# Altium schematic sheet BLDC-PWR-CONROLLER.SchDoc
size 420 x 297 mm; DocumentNumber: АБВГ.000000.000 Э3; SheetNumber: 4; PageSetup: Record=PageOptions|CenterHorizontal=False|CenterVertical=False|PrintScale=0.95|XCorrection=0.00|YCorrection=0.00|PrintKind=1|BorderSize=5000000|LeftOffset=0|BottomOffset=0|Orientation=1|PaperLength=1000|PaperWidth=1000|Scale=100|PaperSource=15|PrintQuality=600|MediaType=1|DitherType=10|PaperKind=A4|PrintScaleMode=1; Letter1Column: {}; Letter2Column: {}; Letter3Column: {}; ProcessInspection: ProcessInspection; EngineerName: EngineerName; NormInspection: NormInspection; DocumentType: DocumentType; Mass: Mass; Scale: Scale; Developer1size1str: Developer1size1str; Developer2size1str: Developer2size1str; Developer2size2str: Developer2size2str; Title1size1str: Title1size1str; Title2size1str: Title2size1str; Title2size2str: Title2size2str; Title3size3str: Title3size3str; Title3size2str: Title3size2str; Title3size1str: Title3size1str; FunctionalGroup: #_
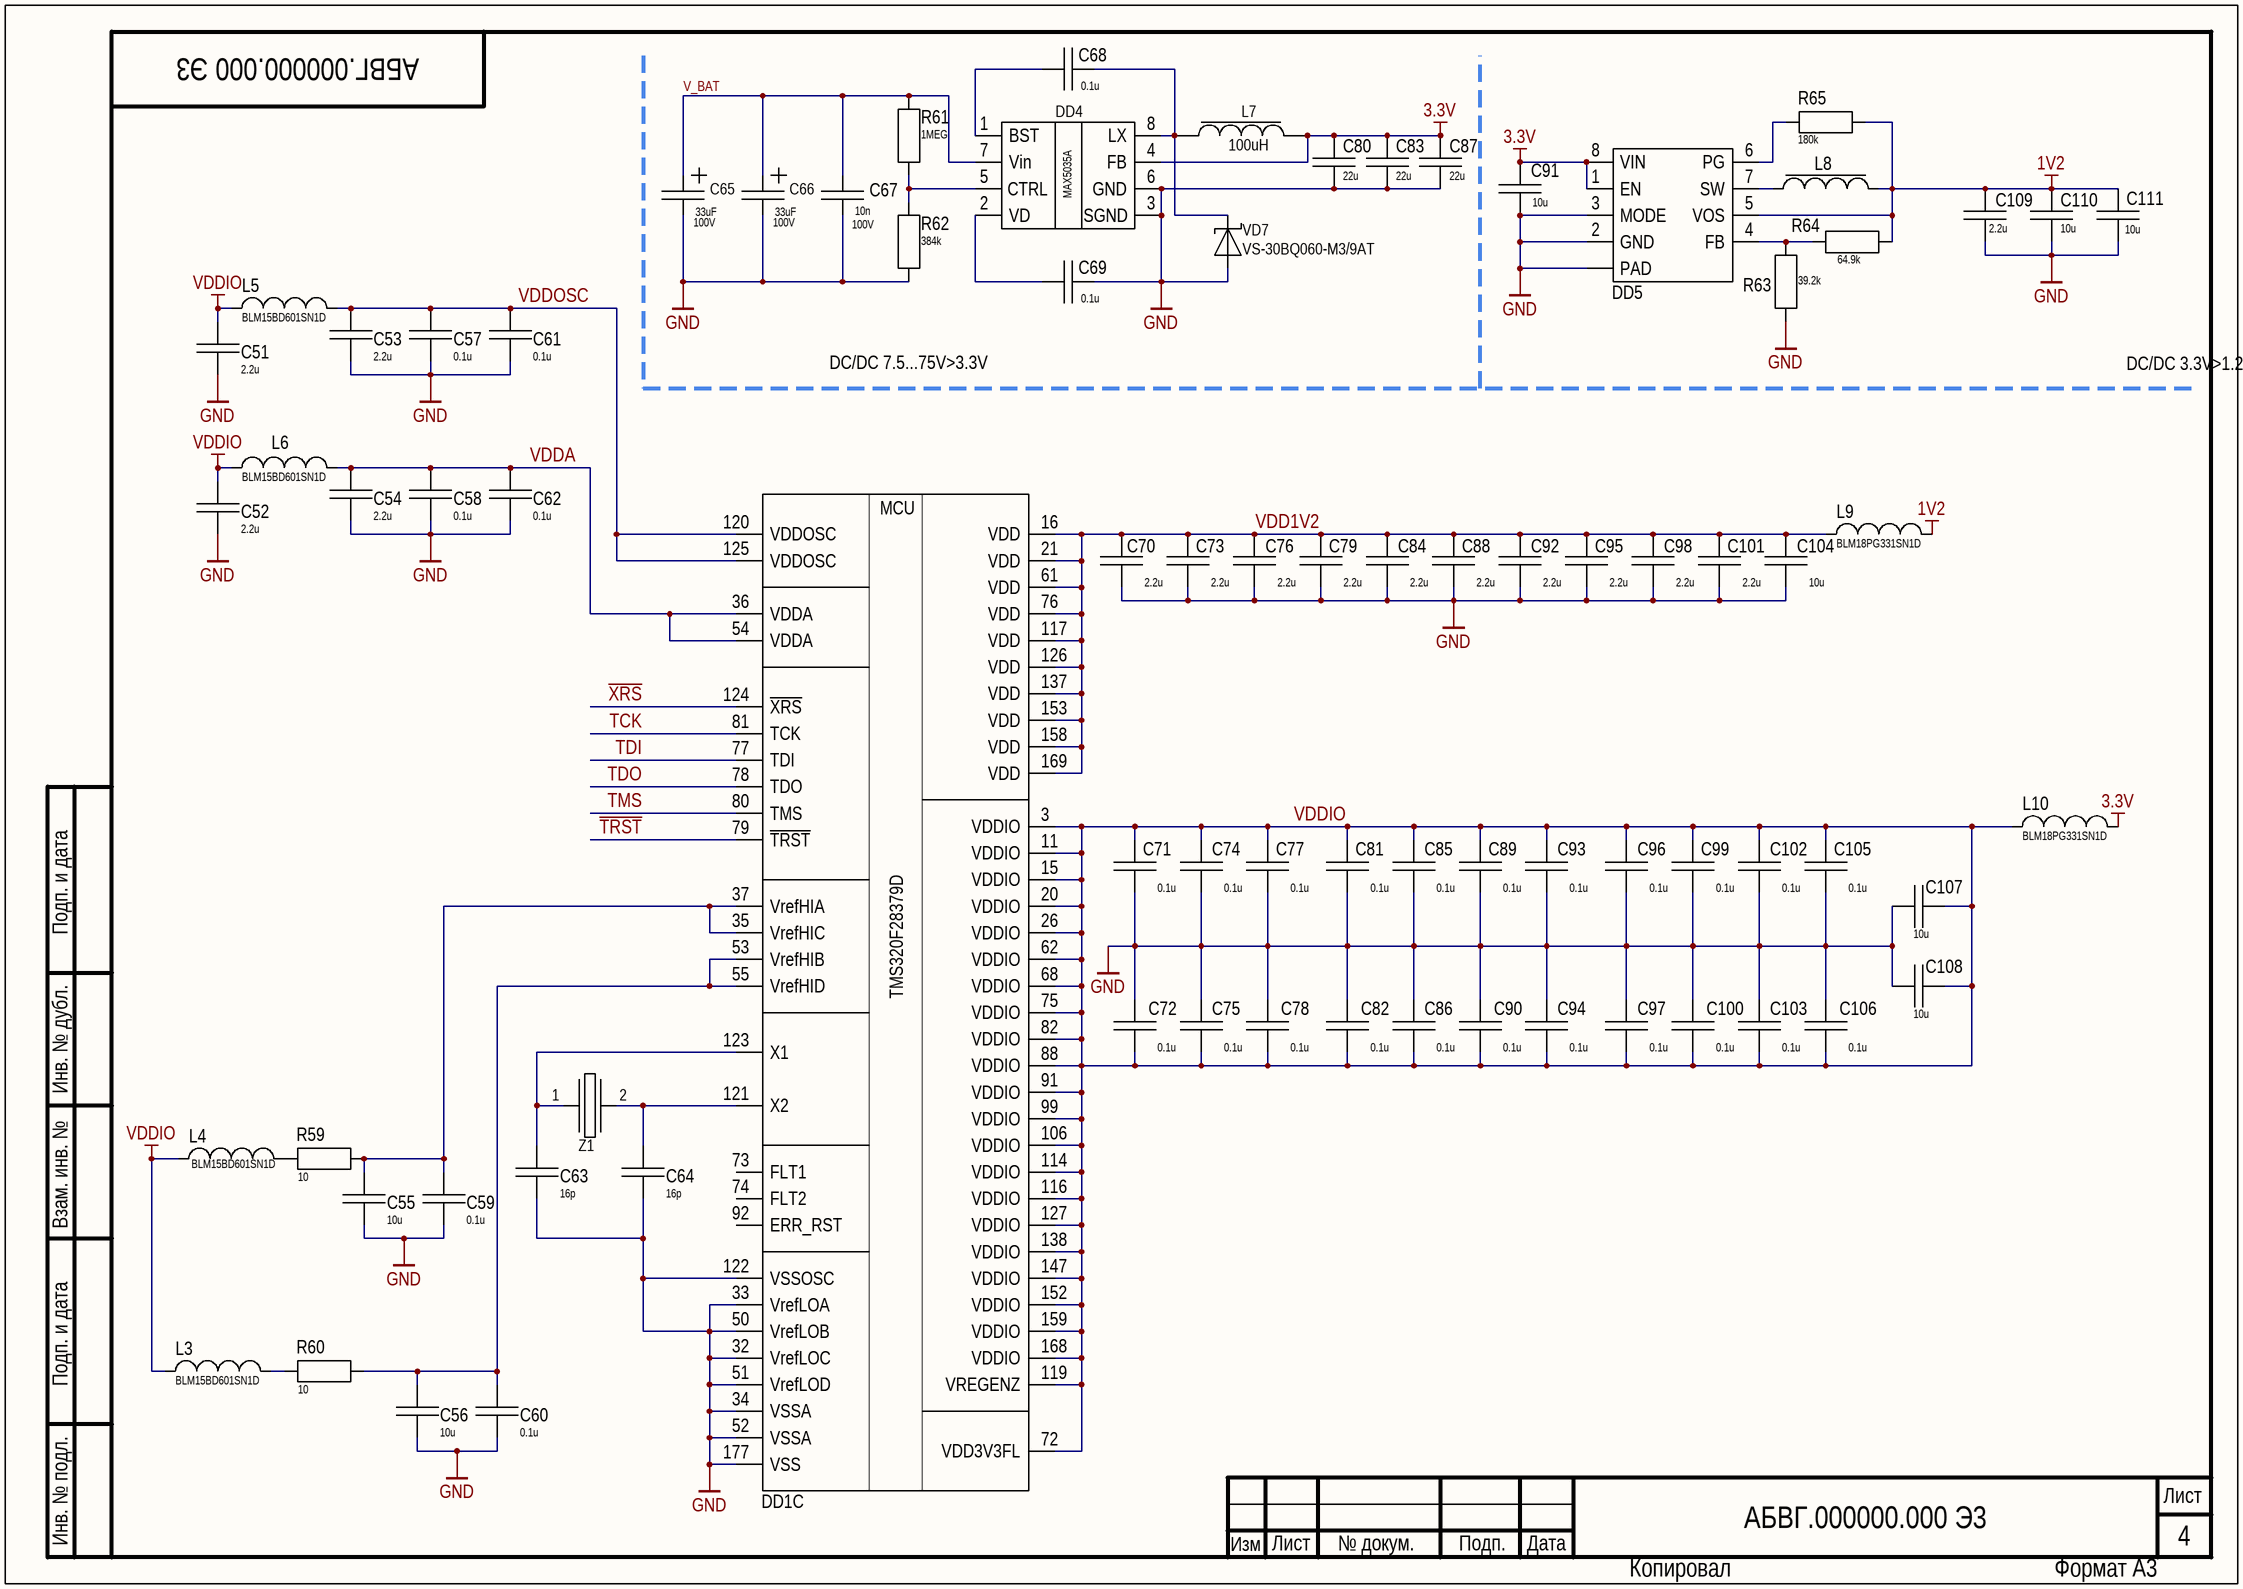
[diagram p0: BLDC-PWR-CONROLLER.SchDoc]

## Parts
C51  2.2u  [CAP: 0402]
C52  2.2u  [CAP: 0402]
C53  2.2u  [CAP: 0402]
C54  2.2u  [CAP: 0402]
C55  10u  [CAP: 0402]
C56  10u  [CAP: 0402]
C57  0.1u  [CAP: 0402]
C58  0.1u  [CAP: 0402]
C59  0.1u  [CAP: 0402]
C60  0.1u  [CAP: 0402]
C61  0.1u  [CAP: 0402]
C62  0.1u  [CAP: 0402]
C63  16p  [CAP: 0402]
C64  16p  [CAP: 0402]
C65  value 33uF  Voltage: 100V  [ECR08]  (hidden comment: ECR0812)
C66  value 33uF  Voltage: 100V  [ECR08]  (hidden comment: ECR0812)
C67  value 10n  Voltage: 100V  [CAP: 0603]
C68  0.1u  [CAP: 0402]
C69  0.1u  [CAP: 0402]
C70  2.2u  [CAP: 0402]
C71  0.1u  [CAP: 0402]
C72  0.1u  [CAP: 0402]
C73  2.2u  [CAP: 0402]
C74  0.1u  [CAP: 0402]
C75  0.1u  [CAP: 0402]
C76  2.2u  [CAP: 0402]
C77  0.1u  [CAP: 0402]
C78  0.1u  [CAP: 0402]
C79  2.2u  [CAP: 0402]
C80  22u  [CAP: 0805]
C81  0.1u  [CAP: 0402]
C82  0.1u  [CAP: 0402]
C83  22u  [CAP: 0805]
C84  2.2u  [CAP: 0402]
C85  0.1u  [CAP: 0402]
C86  0.1u  [CAP: 0402]
C87  22u  [CAP: 0805]
C88  2.2u  [CAP: 0402]
C89  0.1u  [CAP: 0402]
C90  0.1u  [CAP: 0402]
C91  10u  [CAP: 0805]
C92  2.2u  [CAP: 0402]
C93  0.1u  [CAP: 0402]
C94  0.1u  [CAP: 0402]
C95  2.2u  [CAP: 0402]
C96  0.1u  [CAP: 0402]
C97  0.1u  [CAP: 0402]
C98  2.2u  [CAP: 0402]
C99  0.1u  [CAP: 0402]
C100  0.1u  [CAP: 0402]
C101  2.2u  [CAP: 0402]
C102  0.1u  [CAP: 0402]
C103  0.1u  [CAP: 0402]
C104  10u  [CAP: 0402]
C105  0.1u  [CAP: 0402]
C106  0.1u  [CAP: 0402]
C107  10u  [CAP: 0402]
C108  10u  [CAP: 0402]
C109  2.2u  [CAP: 0402]
C110  10u  [CAP: 0805]
C111  10u  [CAP: 0805]
DD1  TMS320F28379DPTP_LACID  [176-HLQFP]  (value not drawn)  (part C of 3)
DD4  MAX5035A  [SOIC-8-150-1.27]
DD5  TPS62080ADSGT  [8-WSON 2.1x2.1]  (value not drawn)
L3  BLM15BD601SN1D  [IND: 0402]
L4  BLM15BD601SN1D  [IND: 0402]
L5  BLM15BD601SN1D  [IND: 0402]
L6  BLM15BD601SN1D  [IND: 0402]
L7  value 100uH  [IND: SRR1208]
L8  LQH3NPN  [IND: LQH3NP]  (value not drawn)
L9  BLM18PG331SN1D  [IND: 0603]
L10  BLM18PG331SN1D  [IND: 0603]
R59  10  [RES: 0402]
R60  10  [RES: 0402]
R61  1MEG  [RES: 0402]
R62  384k  [RES: 0402]
R63  39.2k  [RES: 0402]
R64  64.9k  [RES: 0402]
R65  180k  [RES: 0402]
VD7  PartNumber: VS-30BQ060-M3/9AT  [DIODE: SMC]
Z1  (no value)  [OSC: HC49SM]

## Nets
1V2: C109.2 C110.2 C111.2 DD5.5(VOS) L8.1 L9.2 R64.1 R65.1
3.3V: C80.2 C83.2 C87.2 C91.2 DD4.4(FB) DD5.1(EN) DD5.8(VIN) L7.1 L10.2
GND: C51.1 C52.1 C53.1 C54.1 C55.1 C56.1 C57.1 C58.1 C59.1 C60.1 C61.1 C62.1 C63.1 C64.1 C65.2 C66.2 C67.1 C69.1 C70.1 C71.1 C72.2 C73.1 C74.1 C75.2 C76.1 C77.1 C78.2 C79.1 C80.1 C81.1 C82.2 C83.1 C84.1 C85.1 C86.2 C87.1 C88.1 C89.1 C90.2 C91.1 C92.1 C93.1 C94.2 C95.1 C96.1 C97.2 C98.1 C99.1 C100.2 C101.1 C102.1 C103.2 C104.1 C105.1 C106.2 C107.2 C108.2 C109.1 C110.1 C111.1 DD1.32(VrefLOC) DD1.33(VrefLOA) DD1.34(VSSA) DD1.50(VrefLOB) DD1.51(VrefLOD) DD1.52(VSSA) DD1.122(VSSOSC) DD1.177(VSS) DD4.3(SGND) DD4.6(GND) DD5.0(PAD) DD5.2(GND) DD5.3(MODE) R62.1 R63.1 VD7.1
VDDIO: C51.2 C52.2 C71.2 C72.1 C74.2 C75.1 C77.2 C78.1 C81.2 C82.1 C85.2 C86.1 C89.2 C90.1 C93.2 C94.1 C96.2 C97.1 C99.2 C100.1 C102.2 C103.1 C105.2 C106.1 C107.1 C108.1 DD1.3(VDDIO) DD1.11(VDDIO) DD1.15(VDDIO) DD1.20(VDDIO) DD1.26(VDDIO) DD1.62(VDDIO) DD1.68(VDDIO) DD1.72(VDD3V3FL) DD1.75(VDDIO) DD1.82(VDDIO) DD1.88(VDDIO) DD1.91(VDDIO) DD1.99(VDDIO) DD1.106(VDDIO) DD1.114(VDDIO) DD1.116(VDDIO) DD1.119(VREGENZ) DD1.127(VDDIO) DD1.138(VDDIO) DD1.147(VDDIO) DD1.152(VDDIO) DD1.159(VDDIO) DD1.168(VDDIO) L3.1 L4.1 L5.1 L6.1 L10.1
~{TRST}: DD1.79(~{TRST})
TCK: DD1.81(TCK)
TDI: DD1.77(TDI)
TDO: DD1.78(TDO)
TMS: DD1.80(TMS)
V_BAT: C65.1 C66.1 C67.2 DD4.7(Vin) R61.2
VDD1V2: C70.2 C73.2 C76.2 C79.2 C84.2 C88.2 C92.2 C95.2 C98.2 C101.2 C104.2 DD1.16(VDD) DD1.21(VDD) DD1.61(VDD) DD1.76(VDD) DD1.117(VDD) DD1.126(VDD) DD1.137(VDD) DD1.153(VDD) DD1.158(VDD) DD1.169(VDD) L9.1
VDDA: C54.2 C58.2 C62.2 DD1.36(VDDA) DD1.54(VDDA) L6.2
VDDOSC: C53.2 C57.2 C61.2 DD1.120(VDDOSC) DD1.125(VDDOSC) L5.2
~{XRS}: DD1.124(~{XRS})
NetC55_2: C55.2 C59.2 DD1.35(VrefHIC) DD1.37(VrefHIA) R59.1
NetC56_2: C56.2 C60.2 DD1.53(VrefHIB) DD1.55(VrefHID) R60.1
NetC63_2: C63.2 DD1.123(X1) Z1.1
NetC64_2: C64.2 DD1.121(X2) Z1.2
NetC68_1: C68.1 DD4.8(LX) L7.2 VD7.2
NetC68_2: C68.2 DD4.1(BST)
NetC69_2: C69.2 DD4.2(VD)
NetDD4_5: DD4.5(CTRL) R61.1 R62.2
NetDD5_4: DD5.4(FB) R63.2 R64.2
NetDD5_6: DD5.6(PG) R65.2
NetDD5_7: DD5.7(SW) L8.2
NetL3_2: L3.2 R60.2
NetL4_2: L4.2 R59.2

Not connected (* = marked no-connect by the designer): DD1 73(FLT1) 74(FLT2) 92(ERR_RST)

## Notes on the sheet
- DC/DC 7.5...75V>3.3V
- DC/DC 3.3V>1.2V
- Подп. и дата
- Инв. № дубл.
- Взам. инв. №
- Инв. № подл.
- Лист
- Изм
- № докум.
- Подп.
- Дата
- Копировал
- Формат А3
- (in symbol TMS320F28379DPTP_LACID, part C) MCU; TMS320F28379D

## Library data of the parts
C51-C56 C70 C73 C76 C79 C84 C88 C92 C95 C98 C101 C104 C107-C109 = CAP 0402: PartNumber: CC0402MRX5R5BB106; Voltage: 6.3V
  C51-C54 C70 C73 C76 C79 C84 C88 C92 C95 C98 C101 C109: Value: 2.2u
  C55 C56 C104 C107 C108: Value: 10u
C57-C62 C71 C72 C74 C75 C77 C78 C81 C82 C85 C86 C89 C90 C93 C94 C96 C97 C99 C100 C102 C103 C105 C106 = CAP 0402: PartNumber: C0402C104K8PAC; Manufacturer: Kemet; Voltage: 10V; Type: Capacitor; Temperature_Range: -55/+85; Tolerance: 10%; Value: 0.1u; Case: 0402
C63 C64 = CAP 0402: PartNumber: GRM1555C1H160JA01D; Manufacturer: Kemet; Voltage: 50V; Type: Capacitor; Temperature_Range: -55/+85; Tolerance: 10%; Value: 16p; Case: 0402
C65 C66 = ECR0812: PartNumber: JRB2A330M03500800120000B; Case: 8x12; Link: https://www.chipdip.by/product0/9000565862
C67 = Ceramic_0603: Manufacturer: murata; PartNumber: GRM188R72A103KA01D; ValueManufacturerPartNumber: Ceramic capacitor, 10n, X7R, ±10%, 100V, 0603, -55...+125°C; TypeCapacitor: Ceramic capacitor; Tolerance: ±10%; TypeDielectric: X7R; Package: 0603; HelpURL: https://www.chipdip.by/product/grm188r72a103ka01d; Temperature: -55...+125°C
C68 C69 = CAP 0402: Manufacturer: Kemet; Voltage: 100V; Type: Capacitor; Temperature_Range: -55/+85; Tolerance: 10%; Value: 0.1u; Case: 0402
C80 C83 C87 = CAP 0805: PartNumber: GRM21BR60J226M*; Voltage: 6.3V; Value: 22u
C91 C110 C111 = CAP 0805: PartNumber: CC0402MRX5R5BB106; Voltage: 6.3V; Value: 10u
DD1 = TMS320F28379DPTP_LACID: PartNumber: TMS320F28379DPTPT; Case: HLQFP-176
DD4 = MAX5035*
DD5 = TPS62080ADSGT: PartNumber: TPS61023DRLR
L7 = Inductor_SRR1208: Manufacturer: EPCOS; PartNumber: B82477G4104M000; TypeInductor: Fixed inductor; MaxCurrent: 1.7A; Tolerance: 20%; Link: https://www.chipdip.by/product/b82477g4104m; Temperature: -40...+150°C
L8 = LQH3NPN: PartNumber: LQH3NPN1R0NJ0L; Type: Chip Coil; Value: 1uH; Case: 1212; Max DC current: *
R59 R60 = RES 0402: PartNumber: RC0402FR-071KL; Tolerance: 1%; Value: 10; Manufacturer: *; Type: Resistor; Temperature_Range: *; Composition: *; Voltage: *; Case: 0402
R61-R63 = RES 0402: PartNumber: RC0402FR-1339K2L; Tolerance: 1%; Manufacturer: *; Type: Resistor; Temperature_Range: *; Composition: *; Voltage: *; Case: 0402
  R61: Value: 1MEG
  R62: Value: 384k
  R63: Value: 39.2k
R64 = RES 0402: PartNumber: RC0402FR-1364K9L; Tolerance: 1%; Value: 64.9k; Manufacturer: *; Type: Resistor; Temperature_Range: *; Composition: *; Voltage: *; Case: 0402
R65 = RES 0402: PartNumber: RC0402FR-07180RL; Tolerance: 1%; Value: 180k; Manufacturer: *; Type: Resistor; Temperature_Range: *; Composition: *; Voltage: *; Case: 0402
VD7 = Schottky_single: Manufacturer: Diodes Incorporated; ValueManufacturerPartNumber: Schottky diode, 80V, 500mA, 1V, 15pF, SOD-123, -55...+150°C; TypeDiode: Schottky diode; Voltage: 80V; Current: 500mA; VoltageDrop: 1V; RecoveryTime: 15pF; Package: SOD-123; HelpURL: https://www.digikey.com/product-detail/en/diodes-incorporated/MBR0580S1-7/MBR0580S1-7DICT-ND/5080371; Temperature: -55...+150°C
Z1 = Crystal_HC-49SM: Manufacturer: Epson; PartNumber: FC-135 32.7680KA-A5; ValueManufacturerPartNumber: Crystal, , 12.5pF, ±20ppm, case 3215, -40...+85°C; LoadCapacitance: 12.5pF; Tolerance: ±20ppm; Package: case 3215; HelpURL: https://www.digikey.com/product-detail/en/epson/FC-135-32.7680KA-A5/SER4103CT-ND/6188447; Temperature: -40...+85°C; TypeOscilator: Crystal
L3-L6 = BLM15BD601SN1D: PartNumber: BLM15BD601SN1D
L9 L10 = BLM18PG331SN1D: PartNumber: BLM18PG331SN1D